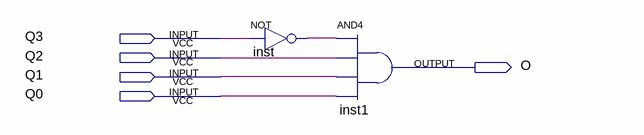
[diagram p0: schematic sheet]
// Quartus schematic OutputMe.bdf as structural Verilog: 2 symbols, 5 pins
module OutputMe (
  input  Q3,
  input  Q2,
  input  Q1,
  input  Q0,
  output O
);

  wire inst_out;

  not inst (inst_out, Q3);
  and inst1 (O, inst_out, Q2, Q1, Q0);
endmodule
